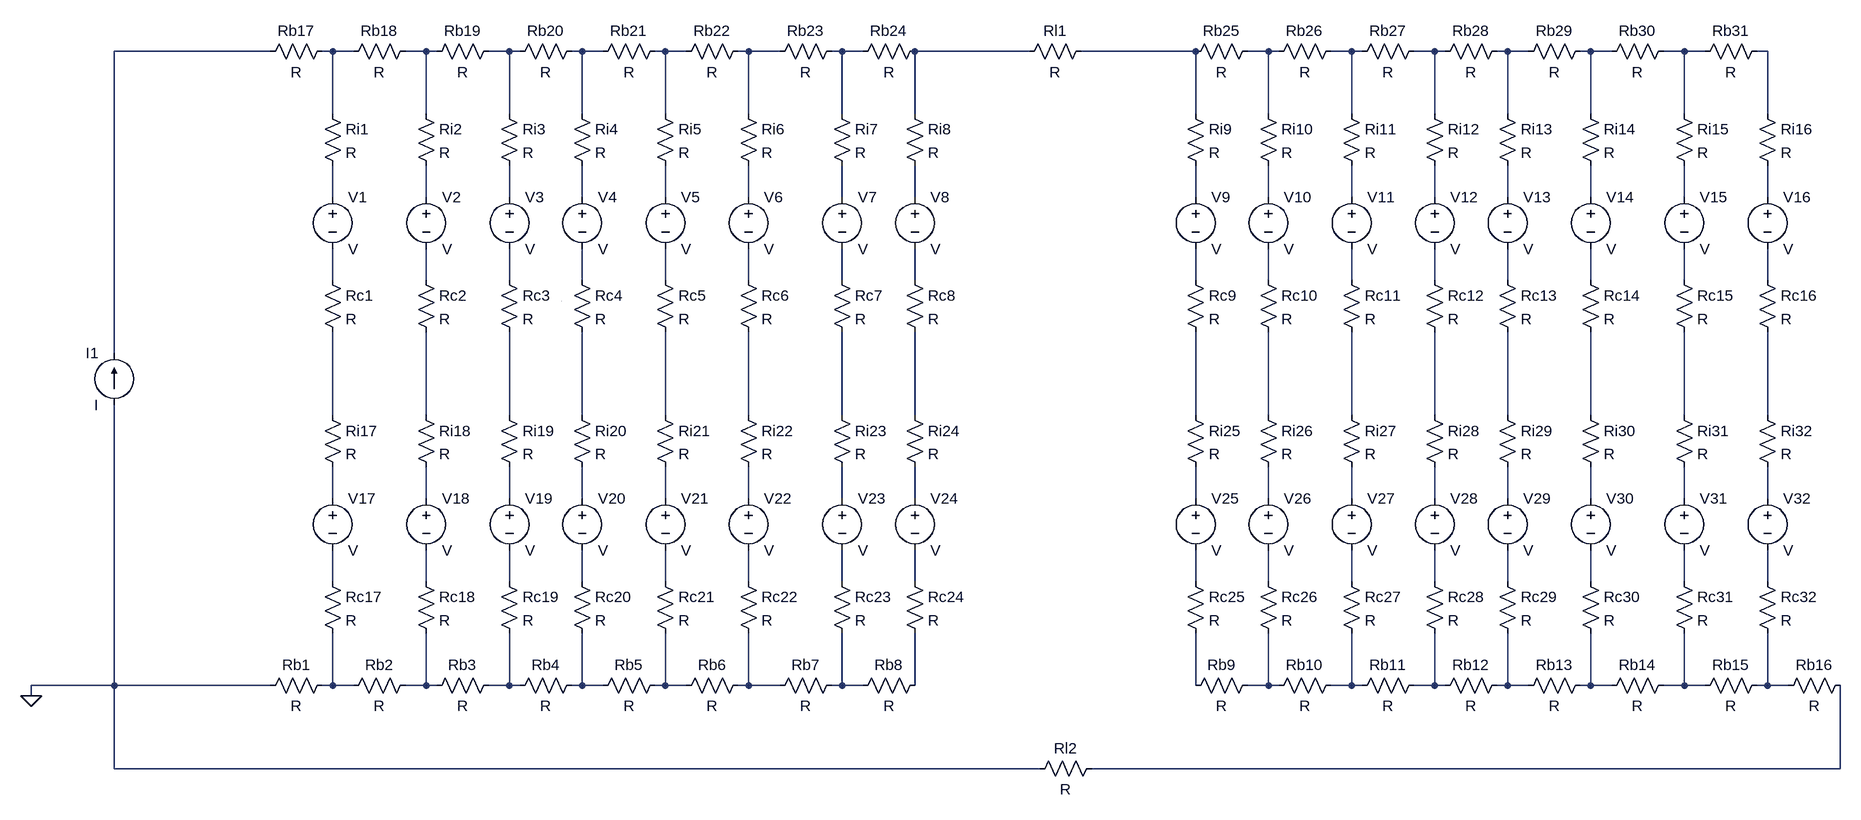
[diagram p0: schematic AMMBa.asc]
AMMBa.asc, the LTspice schematic file:
Version 4
SHEET 1 1992 768
WIRE -448 -384 -688 -384
WIRE -352 -384 -368 -384
WIRE -320 -384 -352 -384
WIRE -208 -384 -240 -384
WIRE -192 -384 -208 -384
WIRE -80 -384 -112 -384
WIRE -64 -384 -80 -384
WIRE 32 -384 16 -384
WIRE 64 -384 32 -384
WIRE 160 -384 144 -384
WIRE 192 -384 160 -384
WIRE 288 -384 272 -384
WIRE 336 -384 288 -384
WIRE 432 -384 416 -384
WIRE 464 -384 432 -384
WIRE 720 -384 544 -384
WIRE 976 -384 800 -384
WIRE 1088 -384 1056 -384
WIRE 1104 -384 1088 -384
WIRE 1216 -384 1184 -384
WIRE 1232 -384 1216 -384
WIRE 1344 -384 1312 -384
WIRE 1360 -384 1344 -384
WIRE 1456 -384 1440 -384
WIRE 1488 -384 1456 -384
WIRE 1584 -384 1568 -384
WIRE 1616 -384 1584 -384
WIRE 1728 -384 1696 -384
WIRE 1760 -384 1728 -384
WIRE 1856 -384 1840 -384
WIRE -352 -288 -352 -384
WIRE -208 -288 -208 -384
WIRE -80 -288 -80 -384
WIRE 32 -288 32 -384
WIRE 160 -288 160 -384
WIRE 288 -288 288 -384
WIRE 432 -288 432 -384
WIRE 544 -288 544 -384
WIRE 976 -288 976 -384
WIRE 1088 -288 1088 -384
WIRE 1216 -288 1216 -384
WIRE 1344 -288 1344 -384
WIRE 1456 -288 1456 -384
WIRE 1584 -288 1584 -384
WIRE 1728 -288 1728 -384
WIRE 1856 -288 1856 -384
WIRE -352 -160 -352 -208
WIRE -208 -160 -208 -208
WIRE -80 -160 -80 -208
WIRE 32 -160 32 -208
WIRE 160 -160 160 -208
WIRE 288 -160 288 -208
WIRE 432 -160 432 -208
WIRE 544 -160 544 -208
WIRE 976 -160 976 -208
WIRE 1088 -160 1088 -208
WIRE 1216 -160 1216 -208
WIRE 1344 -160 1344 -208
WIRE 1456 -160 1456 -208
WIRE 1584 -160 1584 -208
WIRE 1728 -160 1728 -208
WIRE 1856 -160 1856 -208
WIRE -352 -32 -352 -80
WIRE -208 -32 -208 -80
WIRE -80 -32 -80 -80
WIRE 32 -32 32 -80
WIRE 160 -32 160 -80
WIRE 288 -32 288 -80
WIRE 432 -32 432 -80
WIRE 544 -32 544 -80
WIRE 976 -32 976 -80
WIRE 1088 -32 1088 -80
WIRE 1216 -32 1216 -80
WIRE 1344 -32 1344 -80
WIRE 1456 -32 1456 -80
WIRE 1584 -32 1584 -80
WIRE 1728 -32 1728 -80
WIRE 1856 -32 1856 -80
WIRE -688 80 -688 -384
WIRE -352 176 -352 48
WIRE -208 176 -208 48
WIRE -80 176 -80 48
WIRE 32 176 32 48
WIRE 160 176 160 48
WIRE 288 176 288 48
WIRE 432 176 432 48
WIRE 544 176 544 48
WIRE 976 176 976 48
WIRE 1088 176 1088 48
WIRE 1216 176 1216 48
WIRE 1344 176 1344 48
WIRE 1456 176 1456 48
WIRE 1584 176 1584 48
WIRE 1728 176 1728 48
WIRE 1856 176 1856 48
WIRE -352 304 -352 256
WIRE -208 304 -208 256
WIRE -80 304 -80 256
WIRE 32 304 32 256
WIRE 160 304 160 256
WIRE 288 304 288 256
WIRE 432 304 432 256
WIRE 544 304 544 256
WIRE 976 304 976 256
WIRE 1088 304 1088 256
WIRE 1216 304 1216 256
WIRE 1344 304 1344 256
WIRE 1456 304 1456 256
WIRE 1584 304 1584 256
WIRE 1728 304 1728 256
WIRE 1856 304 1856 256
WIRE -352 432 -352 384
WIRE -208 432 -208 384
WIRE -80 432 -80 384
WIRE 32 432 32 384
WIRE 160 432 160 384
WIRE 288 432 288 384
WIRE 432 432 432 384
WIRE 544 432 544 384
WIRE 976 432 976 384
WIRE 1088 432 1088 384
WIRE 1216 432 1216 384
WIRE 1344 432 1344 384
WIRE 1456 432 1456 384
WIRE 1584 432 1584 384
WIRE 1728 432 1728 384
WIRE 1856 432 1856 384
WIRE -688 592 -688 160
WIRE -688 592 -816 592
WIRE -448 592 -688 592
WIRE -352 592 -352 512
WIRE -352 592 -368 592
WIRE -320 592 -352 592
WIRE -208 592 -208 512
WIRE -208 592 -240 592
WIRE -192 592 -208 592
WIRE -80 592 -80 512
WIRE -80 592 -112 592
WIRE -64 592 -80 592
WIRE 32 592 32 512
WIRE 32 592 16 592
WIRE 64 592 32 592
WIRE 160 592 160 512
WIRE 160 592 144 592
WIRE 192 592 160 592
WIRE 288 592 288 512
WIRE 288 592 272 592
WIRE 336 592 288 592
WIRE 432 592 432 512
WIRE 432 592 416 592
WIRE 464 592 432 592
WIRE 544 592 544 512
WIRE 976 592 976 512
WIRE 1088 592 1088 512
WIRE 1088 592 1056 592
WIRE 1104 592 1088 592
WIRE 1216 592 1216 512
WIRE 1216 592 1184 592
WIRE 1232 592 1216 592
WIRE 1344 592 1344 512
WIRE 1344 592 1312 592
WIRE 1360 592 1344 592
WIRE 1456 592 1456 512
WIRE 1456 592 1440 592
WIRE 1488 592 1456 592
WIRE 1584 592 1584 512
WIRE 1584 592 1568 592
WIRE 1616 592 1584 592
WIRE 1728 592 1728 512
WIRE 1728 592 1696 592
WIRE 1760 592 1728 592
WIRE 1856 592 1856 512
WIRE 1856 592 1840 592
WIRE 1888 592 1856 592
WIRE -816 608 -816 592
WIRE -688 720 -688 592
WIRE 736 720 -688 720
WIRE 1968 720 1968 592
WIRE 1968 720 816 720
WIRE 0 0 0 0
FLAG -816 608 0
SYMBOL voltage -352 -176 R0
SYMATTR InstName V1
SYMBOL voltage -208 -176 R0
SYMATTR InstName V2
SYMBOL voltage -80 -176 R0
SYMATTR InstName V3
SYMBOL voltage 32 -176 R0
SYMATTR InstName V4
SYMBOL voltage 160 -176 R0
SYMATTR InstName V5
SYMBOL voltage 288 -176 R0
SYMATTR InstName V6
SYMBOL voltage 432 -176 R0
SYMATTR InstName V7
SYMBOL voltage 544 -176 R0
SYMATTR InstName V8
SYMBOL voltage 976 -176 R0
SYMATTR InstName V9
SYMBOL voltage 1088 -176 R0
SYMATTR InstName V10
SYMBOL voltage 1216 -176 R0
SYMATTR InstName V11
SYMBOL voltage 1344 -176 R0
SYMATTR InstName V12
SYMBOL voltage 1456 -176 R0
SYMATTR InstName V13
SYMBOL voltage 1584 -176 R0
SYMATTR InstName V14
SYMBOL voltage 1728 -176 R0
SYMATTR InstName V15
SYMBOL voltage 1856 -176 R0
SYMATTR InstName V16
SYMBOL voltage -352 288 R0
SYMATTR InstName V17
SYMBOL voltage -208 288 R0
SYMATTR InstName V18
SYMBOL voltage -80 288 R0
SYMATTR InstName V19
SYMBOL voltage 32 288 R0
SYMATTR InstName V20
SYMBOL voltage 160 288 R0
SYMATTR InstName V21
SYMBOL voltage 288 288 R0
SYMATTR InstName V22
SYMBOL voltage 432 288 R0
SYMATTR InstName V23
SYMBOL voltage 544 288 R0
SYMATTR InstName V24
SYMBOL voltage 976 288 R0
SYMATTR InstName V25
SYMBOL voltage 1088 288 R0
SYMATTR InstName V26
SYMBOL voltage 1216 288 R0
SYMATTR InstName V27
SYMBOL voltage 1344 288 R0
SYMATTR InstName V28
SYMBOL voltage 1456 288 R0
SYMATTR InstName V29
SYMBOL voltage 1584 288 R0
SYMATTR InstName V30
SYMBOL voltage 1728 288 R0
SYMATTR InstName V31
SYMBOL voltage 1856 288 R0
SYMATTR InstName V32
SYMBOL res -368 -304 R0
SYMATTR InstName Ri1
SYMBOL res -224 -304 R0
SYMATTR InstName Ri2
SYMBOL res -96 -304 R0
SYMATTR InstName Ri3
SYMBOL res 16 -304 R0
SYMATTR InstName Ri4
SYMBOL res 144 -304 R0
SYMATTR InstName Ri5
SYMBOL res 272 -304 R0
SYMATTR InstName Ri6
SYMBOL res 416 -304 R0
SYMATTR InstName Ri7
SYMBOL res 528 -304 R0
SYMATTR InstName Ri8
SYMBOL res 960 -304 R0
SYMATTR InstName Ri9
SYMBOL res 1072 -304 R0
SYMATTR InstName Ri10
SYMBOL res 1200 -304 R0
SYMATTR InstName Ri11
SYMBOL res 1328 -304 R0
SYMATTR InstName Ri12
SYMBOL res 1440 -304 R0
SYMATTR InstName Ri13
SYMBOL res 1568 -304 R0
SYMATTR InstName Ri14
SYMBOL res 1712 -304 R0
SYMATTR InstName Ri15
SYMBOL res 1840 -304 R0
SYMATTR InstName Ri16
SYMBOL res -368 160 R0
SYMATTR InstName Ri17
SYMBOL res -224 160 R0
SYMATTR InstName Ri18
SYMBOL res -96 160 R0
SYMATTR InstName Ri19
SYMBOL res 16 160 R0
SYMATTR InstName Ri20
SYMBOL res 144 160 R0
SYMATTR InstName Ri21
SYMBOL res 272 160 R0
SYMATTR InstName Ri22
SYMBOL res 416 160 R0
SYMATTR InstName Ri23
SYMBOL res 528 160 R0
SYMATTR InstName Ri24
SYMBOL res 960 160 R0
SYMATTR InstName Ri25
SYMBOL res 1072 160 R0
SYMATTR InstName Ri26
SYMBOL res 1200 160 R0
SYMATTR InstName Ri27
SYMBOL res 1328 160 R0
SYMATTR InstName Ri28
SYMBOL res 1440 160 R0
SYMATTR InstName Ri29
SYMBOL res 1568 160 R0
SYMATTR InstName Ri30
SYMBOL res 1712 160 R0
SYMATTR InstName Ri31
SYMBOL res 1840 160 R0
SYMATTR InstName Ri32
SYMBOL res -352 576 R90
WINDOW 0 0 56 VBottom 2
WINDOW 3 32 56 VTop 2
SYMATTR InstName Rb1
SYMBOL res -224 576 R90
WINDOW 0 0 56 VBottom 2
WINDOW 3 32 56 VTop 2
SYMATTR InstName Rb2
SYMBOL res -96 576 R90
WINDOW 0 0 56 VBottom 2
WINDOW 3 32 56 VTop 2
SYMATTR InstName Rb3
SYMBOL res 32 576 R90
WINDOW 0 0 56 VBottom 2
WINDOW 3 32 56 VTop 2
SYMATTR InstName Rb4
SYMBOL res 160 576 R90
WINDOW 0 0 56 VBottom 2
WINDOW 3 32 56 VTop 2
SYMATTR InstName Rb5
SYMBOL res 288 576 R90
WINDOW 0 0 56 VBottom 2
WINDOW 3 32 56 VTop 2
SYMATTR InstName Rb6
SYMBOL res 432 576 R90
WINDOW 0 0 56 VBottom 2
WINDOW 3 32 56 VTop 2
SYMATTR InstName Rb7
SYMBOL res 560 576 R90
WINDOW 0 0 56 VBottom 2
WINDOW 3 32 56 VTop 2
SYMATTR InstName Rb8
SYMBOL res 1072 576 R90
WINDOW 0 0 56 VBottom 2
WINDOW 3 32 56 VTop 2
SYMATTR InstName Rb9
SYMBOL res 1200 576 R90
WINDOW 0 0 56 VBottom 2
WINDOW 3 32 56 VTop 2
SYMATTR InstName Rb10
SYMBOL res 1328 576 R90
WINDOW 0 0 56 VBottom 2
WINDOW 3 32 56 VTop 2
SYMATTR InstName Rb11
SYMBOL res 1456 576 R90
WINDOW 0 0 56 VBottom 2
WINDOW 3 32 56 VTop 2
SYMATTR InstName Rb12
SYMBOL res 1584 576 R90
WINDOW 0 0 56 VBottom 2
WINDOW 3 32 56 VTop 2
SYMATTR InstName Rb13
SYMBOL res 1712 576 R90
WINDOW 0 0 56 VBottom 2
WINDOW 3 32 56 VTop 2
SYMATTR InstName Rb14
SYMBOL res 1856 576 R90
WINDOW 0 0 56 VBottom 2
WINDOW 3 32 56 VTop 2
SYMATTR InstName Rb15
SYMBOL res 1984 576 R90
WINDOW 0 0 56 VBottom 2
WINDOW 3 32 56 VTop 2
SYMATTR InstName Rb16
SYMBOL res -352 -400 R90
WINDOW 0 0 56 VBottom 2
WINDOW 3 32 56 VTop 2
SYMATTR InstName Rb17
SYMBOL res -224 -400 R90
WINDOW 0 0 56 VBottom 2
WINDOW 3 32 56 VTop 2
SYMATTR InstName Rb18
SYMBOL res -96 -400 R90
WINDOW 0 0 56 VBottom 2
WINDOW 3 32 56 VTop 2
SYMATTR InstName Rb19
SYMBOL res 32 -400 R90
WINDOW 0 0 56 VBottom 2
WINDOW 3 32 56 VTop 2
SYMATTR InstName Rb20
SYMBOL res 160 -400 R90
WINDOW 0 0 56 VBottom 2
WINDOW 3 32 56 VTop 2
SYMATTR InstName Rb21
SYMBOL res 288 -400 R90
WINDOW 0 0 56 VBottom 2
WINDOW 3 32 56 VTop 2
SYMATTR InstName Rb22
SYMBOL res 432 -400 R90
WINDOW 0 0 56 VBottom 2
WINDOW 3 32 56 VTop 2
SYMATTR InstName Rb23
SYMBOL res 560 -400 R90
WINDOW 0 0 56 VBottom 2
WINDOW 3 32 56 VTop 2
SYMATTR InstName Rb24
SYMBOL res 1072 -400 R90
WINDOW 0 0 56 VBottom 2
WINDOW 3 32 56 VTop 2
SYMATTR InstName Rb25
SYMBOL res 1200 -400 R90
WINDOW 0 0 56 VBottom 2
WINDOW 3 32 56 VTop 2
SYMATTR InstName Rb26
SYMBOL res 1328 -400 R90
WINDOW 0 0 56 VBottom 2
WINDOW 3 32 56 VTop 2
SYMATTR InstName Rb27
SYMBOL res 1456 -400 R90
WINDOW 0 0 56 VBottom 2
WINDOW 3 32 56 VTop 2
SYMATTR InstName Rb28
SYMBOL res 1584 -400 R90
WINDOW 0 0 56 VBottom 2
WINDOW 3 32 56 VTop 2
SYMATTR InstName Rb29
SYMBOL res 1712 -400 R90
WINDOW 0 0 56 VBottom 2
WINDOW 3 32 56 VTop 2
SYMATTR InstName Rb30
SYMBOL res 1856 -400 R90
WINDOW 0 0 56 VBottom 2
WINDOW 3 32 56 VTop 2
SYMATTR InstName Rb31
SYMBOL res -368 -48 R0
SYMATTR InstName Rc1
SYMBOL res -224 -48 R0
SYMATTR InstName Rc2
SYMBOL res -96 -48 R0
SYMATTR InstName Rc3
SYMBOL res 16 -48 R0
SYMATTR InstName Rc4
SYMBOL res 144 -48 R0
SYMATTR InstName Rc5
SYMBOL res 272 -48 R0
SYMATTR InstName Rc6
SYMBOL res 416 -48 R0
SYMATTR InstName Rc7
SYMBOL res 528 -48 R0
SYMATTR InstName Rc8
SYMBOL res 960 -48 R0
SYMATTR InstName Rc9
SYMBOL res 1072 -48 R0
SYMATTR InstName Rc10
SYMBOL res 1200 -48 R0
SYMATTR InstName Rc11
SYMBOL res 1328 -48 R0
SYMATTR InstName Rc12
SYMBOL res 1440 -48 R0
SYMATTR InstName Rc13
SYMBOL res 1568 -48 R0
SYMATTR InstName Rc14
SYMBOL res 1712 -48 R0
SYMATTR InstName Rc15
SYMBOL res 1840 -48 R0
SYMATTR InstName Rc16
SYMBOL res -368 416 R0
SYMATTR InstName Rc17
SYMBOL res -224 416 R0
SYMATTR InstName Rc18
SYMBOL res -96 416 R0
SYMATTR InstName Rc19
SYMBOL res 16 416 R0
SYMATTR InstName Rc20
SYMBOL res 144 416 R0
SYMATTR InstName Rc21
SYMBOL res 272 416 R0
SYMATTR InstName Rc22
SYMBOL res 416 416 R0
SYMATTR InstName Rc23
SYMBOL res 528 416 R0
SYMATTR InstName Rc24
SYMBOL res 960 416 R0
SYMATTR InstName Rc25
SYMBOL res 1072 416 R0
SYMATTR InstName Rc26
SYMBOL res 1200 416 R0
SYMATTR InstName Rc27
SYMBOL res 1328 416 R0
SYMATTR InstName Rc28
SYMBOL res 1440 416 R0
SYMATTR InstName Rc29
SYMBOL res 1568 416 R0
SYMATTR InstName Rc30
SYMBOL res 1712 416 R0
SYMATTR InstName Rc31
SYMBOL res 1840 416 R0
SYMATTR InstName Rc32
SYMBOL current -688 160 R180
WINDOW 0 24 80 Left 2
WINDOW 3 24 0 Left 2
SYMATTR InstName I1
SYMBOL res 816 -400 R90
WINDOW 0 0 56 VBottom 2
WINDOW 3 32 56 VTop 2
SYMATTR InstName Rl1
SYMBOL res 832 704 R90
WINDOW 0 0 56 VBottom 2
WINDOW 3 32 56 VTop 2
SYMATTR InstName Rl2

The netlist it stands for:
* AMMBa.asc
V1 N018 N034 V
V2 N019 N035 V
V3 N020 N036 V
V4 N021 N037 V
V5 N022 N038 V
V6 N023 N039 V
V7 N024 N040 V
V8 N025 N041 V
V9 N026 N042 V
V10 N027 N043 V
V11 N028 N044 V
V12 N029 N045 V
V13 N030 N046 V
V14 N031 N047 V
V15 N032 N048 V
V16 N033 N049 V
V17 N066 N082 V
V18 N067 N083 V
V19 N068 N084 V
V20 N069 N085 V
V21 N070 N086 V
V22 N071 N087 V
V23 N072 N088 V
V24 N073 N089 V
V25 N074 N090 V
V26 N075 N091 V
V27 N076 N092 V
V28 N077 N093 V
V29 N078 N094 V
V30 N079 N095 V
V31 N080 N096 V
V32 N081 N097 V
Ri1 N002 N018 R
Ri2 N003 N019 R
Ri3 N004 N020 R
Ri4 N005 N021 R
Ri5 N006 N022 R
Ri6 N007 N023 R
Ri7 N008 N024 R
Ri8 N009 N025 R
Ri9 N010 N026 R
Ri10 N011 N027 R
Ri11 N012 N028 R
Ri12 N013 N029 R
Ri13 N014 N030 R
Ri14 N015 N031 R
Ri15 N016 N032 R
Ri16 N017 N033 R
Ri17 N050 N066 R
Ri18 N051 N067 R
Ri19 N052 N068 R
Ri20 N053 N069 R
Ri21 N054 N070 R
Ri22 N055 N071 R
Ri23 N056 N072 R
Ri24 N057 N073 R
Ri25 N058 N074 R
Ri26 N059 N075 R
Ri27 N060 N076 R
Ri28 N061 N077 R
Ri29 N062 N078 R
Ri30 N063 N079 R
Ri31 N064 N080 R
Ri32 N065 N081 R
Rb1 N098 0 R
Rb2 N099 N098 R
Rb3 N100 N099 R
Rb4 N101 N100 R
Rb5 N102 N101 R
Rb6 N103 N102 R
Rb7 N104 N103 R
Rb8 N105 N104 R
Rb9 N107 N106 R
Rb10 N108 N107 R
Rb11 N109 N108 R
Rb12 N110 N109 R
Rb13 N111 N110 R
Rb14 N112 N111 R
Rb15 N113 N112 R
Rb16 N114 N113 R
Rb17 N002 N001 R
Rb18 N003 N002 R
Rb19 N004 N003 R
Rb20 N005 N004 R
Rb21 N006 N005 R
Rb22 N007 N006 R
Rb23 N008 N007 R
Rb24 N009 N008 R
Rb25 N011 N010 R
Rb26 N012 N011 R
Rb27 N013 N012 R
Rb28 N014 N013 R
Rb29 N015 N014 R
Rb30 N016 N015 R
Rb31 N017 N016 R
Rc1 N034 N050 R
Rc2 N035 N051 R
Rc3 N036 N052 R
Rc4 N037 N053 R
Rc5 N038 N054 R
Rc6 N039 N055 R
Rc7 N040 N056 R
Rc8 N041 N057 R
Rc9 N042 N058 R
Rc10 N043 N059 R
Rc11 N044 N060 R
Rc12 N045 N061 R
Rc13 N046 N062 R
Rc14 N047 N063 R
Rc15 N048 N064 R
Rc16 N049 N065 R
Rc17 N082 N098 R
Rc18 N083 N099 R
Rc19 N084 N100 R
Rc20 N085 N101 R
Rc21 N086 N102 R
Rc22 N087 N103 R
Rc23 N088 N104 R
Rc24 N089 N105 R
Rc25 N090 N106 R
Rc26 N091 N107 R
Rc27 N092 N108 R
Rc28 N093 N109 R
Rc29 N094 N110 R
Rc30 N095 N111 R
Rc31 N096 N112 R
Rc32 N097 N113 R
I1 0 N001 I
Rl1 N010 N009 R
Rl2 N114 0 R
.backanno
.end